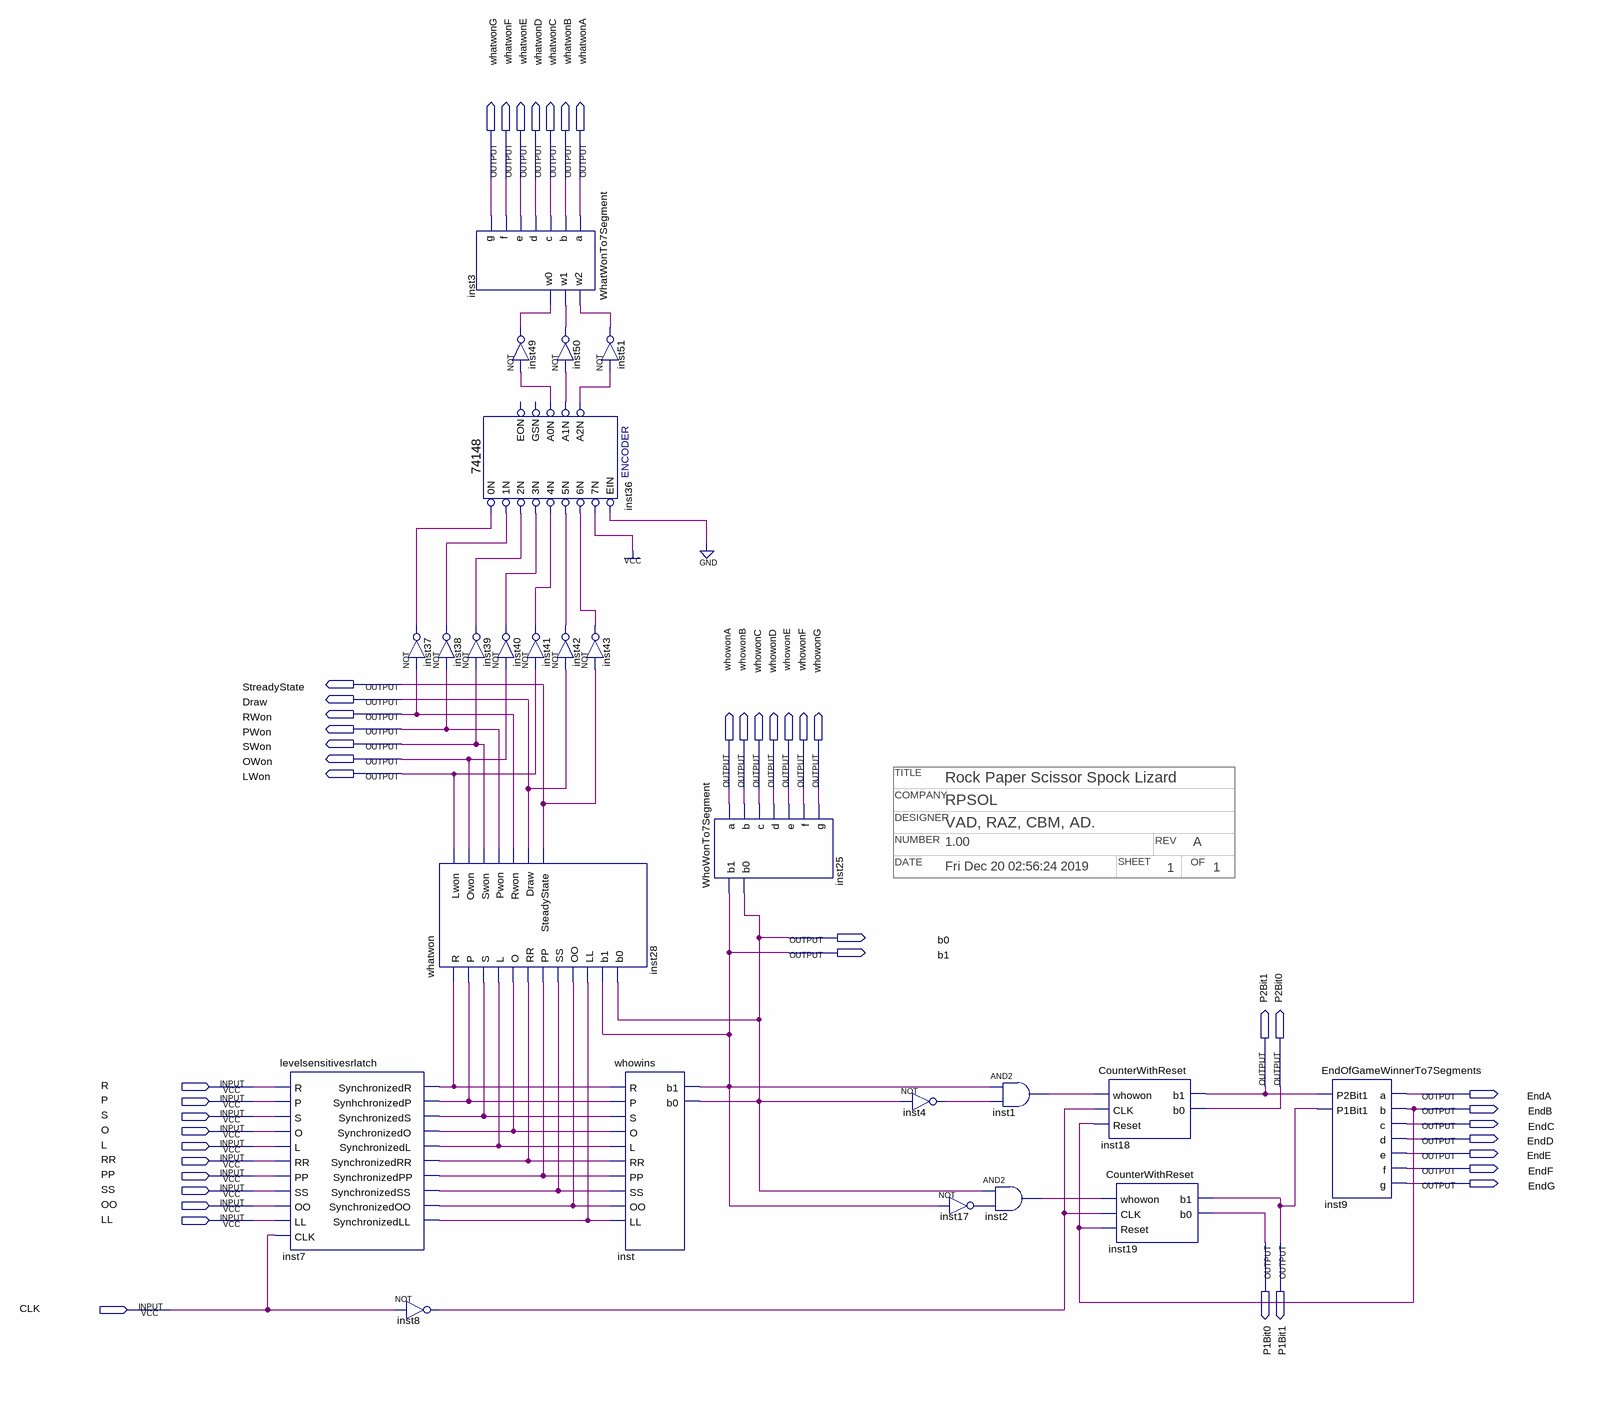
[diagram p0: schematic sheet]
// Quartus schematic full.bdf as structural Verilog: 24 symbols, 45 pins
// Title block: TITLE: Rock Paper Scissor Spock Lizard; COMPANY: RPSOL; DESIGNER: VAD, RAZ, CBM, AD.; NUMBER: 1.00; REV: A; DATE: Fri Dec 20 02:56:24 2019; SHEET: 1; OF: 1
module full (
  input  R,
  input  P,
  input  S,
  input  O,
  input  L,
  input  RR,
  input  PP,
  input  SS,
  input  OO,
  input  LL,
  input  CLK,
  output whatwonG,
  output whatwonF,
  output whatwonE,
  output whatwonD,
  output whatwonC,
  output whatwonB,
  output whatwonA,
  output StreadyState,
  output Draw,
  output RWon,
  output PWon,
  output SWon,
  output OWon,
  output LWon,
  output whowonA,
  output whowonB,
  output whowonC,
  output whowonD,
  output whowonE,
  output whowonF,
  output whowonG,
  output b0,
  output b1,
  output P2Bit1,
  output P2Bit0,
  output EndA,
  output EndB,
  output EndC,
  output EndD,
  output EndE,
  output EndF,
  output EndG,
  output P1Bit0,
  output P1Bit1
);

  wire inst1_out, inst2_out, inst4_out, inst7_synchronizedl, inst7_synchronizedll, inst7_synchronizedo,
       inst7_synchronizedoo, inst7_synchronizedpp, inst7_synchronizedr, inst7_synchronizedrr,
       inst7_synchronizeds, inst7_synchronizedss, inst7_synhchronizedp, inst8_out, inst17_out, inst36_a0n,
       inst36_a1n, inst36_a2n, inst37_out, inst38_out, inst39_out, inst40_out, inst41_out, inst42_out,
       inst43_out, inst49_out, inst50_out, inst51_out;

  levelsensitivesrlatch inst7 (
    .R(R), .P(P), .S(S), .O(O), .L(L), .RR(RR), .PP(PP), .SS(SS), .OO(OO), .LL(LL), .CLK(CLK),
    .SynchronizedR(inst7_synchronizedr), .SynhchronizedP(inst7_synhchronizedp),
    .SynchronizedS(inst7_synchronizeds), .SynchronizedO(inst7_synchronizedo),
    .SynchronizedL(inst7_synchronizedl), .SynchronizedRR(inst7_synchronizedrr),
    .SynchronizedPP(inst7_synchronizedpp), .SynchronizedSS(inst7_synchronizedss),
    .SynchronizedOO(inst7_synchronizedoo), .SynchronizedLL(inst7_synchronizedll));
  not inst37 (inst37_out, RWon);
  not inst8 (inst8_out, CLK);
  WhatWonTo7Segment inst3 (
    .w2(inst51_out), .w1(inst50_out), .w0(inst49_out), .a(whatwonA), .b(whatwonB), .c(whatwonC),
    .d(whatwonD), .e(whatwonE), .f(whatwonF), .g(whatwonG));
  \74148  inst36 (
    .\5N (inst42_out), .\0N (inst37_out), .\1N (inst38_out), .\2N (inst39_out), .\3N (inst40_out),
    .\4N (inst41_out), .EIN(1'b0), .\6N (inst43_out), .\7N (1'b1), .A1N(inst36_a1n), .A0N(inst36_a0n),
    .A2N(inst36_a2n));  // open: EON, GSN
  not inst38 (inst38_out, PWon);
  not inst39 (inst39_out, SWon);
  whatwon inst28 (
    .R(inst7_synchronizedr), .P(inst7_synhchronizedp), .S(inst7_synchronizeds), .L(inst7_synchronizedl),
    .O(inst7_synchronizedo), .RR(inst7_synchronizedrr), .PP(inst7_synchronizedpp), .SS(inst7_synchronizedss),
    .OO(inst7_synchronizedoo), .LL(inst7_synchronizedll), .b1(b1), .b0(b0), .Lwon(LWon), .Owon(OWon),
    .Swon(SWon), .Pwon(PWon), .Rwon(RWon), .Draw(Draw), .SteadyState(StreadyState));
  not inst49 (inst49_out, inst36_a0n);
  not inst40 (inst40_out, OWon);
  not inst41 (inst41_out, LWon);
  not inst50 (inst50_out, inst36_a1n);
  not inst51 (inst51_out, inst36_a2n);
  not inst42 (inst42_out, Draw);
  not inst43 (inst43_out, StreadyState);
  whowins inst (
    .R(inst7_synchronizedr), .P(inst7_synhchronizedp), .S(inst7_synchronizeds), .O(inst7_synchronizedo),
    .L(inst7_synchronizedl), .RR(inst7_synchronizedrr), .PP(inst7_synchronizedpp), .SS(inst7_synchronizedss),
    .OO(inst7_synchronizedoo), .LL(inst7_synchronizedll), .b1(b1), .b0(b0));
  WhoWonTo7Segment inst25 (
    .b1(b1), .b0(b0), .a(whowonA), .b(whowonB), .c(whowonC), .d(whowonD), .e(whowonE), .f(whowonF),
    .g(whowonG));
  not inst4 (inst4_out, b0);
  not inst17 (inst17_out, b1);
  and inst1 (inst1_out, b1, inst4_out);
  and inst2 (inst2_out, b0, inst17_out);
  CounterWithReset inst18 (.whowon(inst1_out), .CLK(inst8_out), .Reset(EndB), .b1(P2Bit1), .b0(P2Bit0));
  CounterWithReset inst19 (.whowon(inst2_out), .CLK(inst8_out), .Reset(EndB), .b1(P1Bit1), .b0(P1Bit0));
  EndOfGameWinnerTo7Segments inst9 (
    .P2Bit1(P2Bit1), .P1Bit1(P1Bit1), .a(EndA), .b(EndB), .c(EndC), .d(EndD), .e(EndE), .f(EndF), .g(EndG));
endmodule
